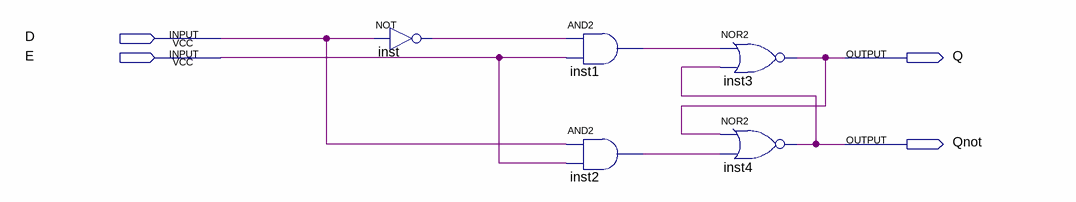
[diagram p0: schematic sheet]
// Quartus schematic d_latch.bdf as structural Verilog: 5 symbols, 4 pins
module d_latch (
  input  D,
  input  E,
  output Q,
  output Qnot
);

  wire inst1_out, inst2_out, inst_out;

  not inst (inst_out, D);
  and inst1 (inst1_out, inst_out, E);
  and inst2 (inst2_out, D, E);
  nor inst3 (Q, inst1_out, Qnot);
  nor inst4 (Qnot, Q, inst2_out);
endmodule
